# Altium project Secondary Protection.PrjPCB
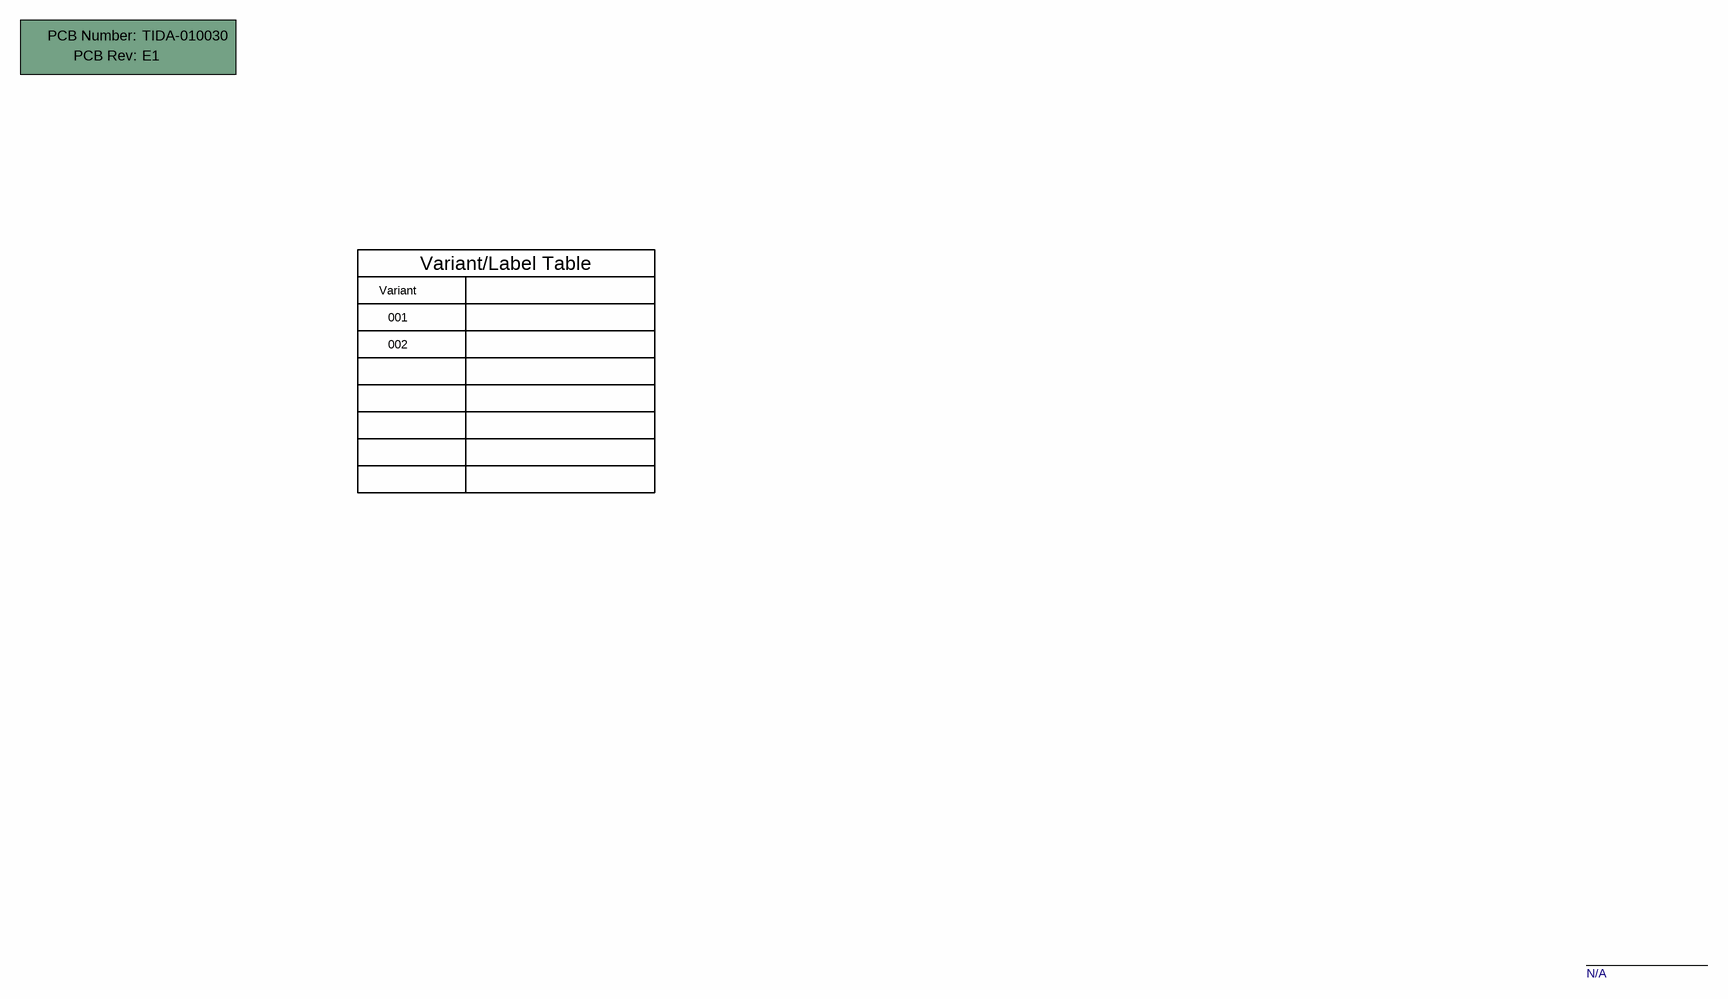
[diagram p0: EVM_Hardware.SchDoc]
TID: TIDA-010030; TechSupport: http://www.ti.com/support; SCH_Rev: E1; PRJ_Title: Accurate Gauging & 50uA Standby Current 13S 48V Liion  Battery Pack Reference Design; PRJ_Number: TIDA-010030; PRJ_Engineer: Ryan Tan; PRJ_Customer: Public Release; PCB_Rev: E1; PCB_Layout: Ryan Tan; CopyrightYear: 2018
2 sheets, 48 parts. Net scope: global (net labels, ports and power ports of the same name join across sheets).
Board file: Secondary Protection.PcbDoc
Sheets:
  EVM_Hardware.SchDoc
  Secondary protection.SchDoc

## Sheet EVM_Hardware.SchDoc
size 431 x 279 mm; Date: Not shown in title block; ApprovedBy: Not shown in title block; CheckedBy: Not shown in title block; Author: Not shown in title block; CompanyName: Not shown in title block; Engineer: Not shown in title block; Organization: Not shown in title block; Address1: Not shown in title block; Address2: Not shown in title block; Address3: Not shown in title block; Address4: Not shown in title block; DocumentNumber: 1; Revision: Use project parameter SCH_Rev; SheetNumber: 3; SheetTotal: 3; PageSetup: Record=PageOptions|CenterHorizontal=True|CenterVertical=True|PrintScale=1.00|XCorrection=1.00|YCorrection=1.00|PrintKind=0|BorderSize=5000000|LeftOffset=0|BottomOffset=0|Orientation=2|PaperLength=1000|PaperWidth=1000|Scale=100|PaperSource=15|PrintQuality=600|MediaType=1|DitherType=10|PaperKind=Letter|PrintScaleMode=1; CurrentTime: Not shown in title block; CurrentDate: Not shown in title block; Time: Not shown in title block; DocumentFullPathAndName: Not shown in title block; DocumentName: Not shown in title block; ModifiedDate: Not shown in title block; ImagePath: Not shown in title block

### Parts
!PCB1  Printed Circuit Board  (value not drawn)  (mechanical)

### Notes on the sheet
- Variant
- Variant/Label Table
- 001
- 002
- N/A
- Drawn By:
- SVN Rev:
- Number:
- TID #:
- Orderable:
- Rev:
- Sheet Title:
- File:
- Project Title:
- Designed for:
- Assembly Variant:
- Mod. Date:
- Sheet:
- Size:
- of
- B
- http://www.ti.com
- Texas Instruments and/or its licensors do not warrant the accuracy or completeness of this specification or any information contained therein. Texas Instruments and/or its licensors do not warrant that this design will meet the specifications, will be suitable for your application or fit for any particular purpose, or will operate in an implementation. Texas Instruments and/or its licensors do not warrant that the design is production worthy. You should completely validate and test your design implementation to confirm the system functionality for your application.
- Engineer:
- Contact:
- © Texas Instruments
- (in symbol CMP-0003618-2) PCB Number:; PCB Rev:

### Library data of the parts
!PCB1 = CMP-0003618-2: Manufacturer: Any; PartNumber: TIDA-010030; CompType: PCB; RoHS: O; MountType: N/A; Publisher: Texas Instruments; LatestRevisionDate: 2017-03-09; Key: PCB

## Sheet Secondary protection.SchDoc
size 431 x 279 mm; Date: Not shown in title block; ApprovedBy: Not shown in title block; CheckedBy: Not shown in title block; Author: Not shown in title block; CompanyName: Not shown in title block; Engineer: Not shown in title block; Organization: Not shown in title block; Address1: Not shown in title block; Address2: Not shown in title block; Address3: Not shown in title block; Address4: Not shown in title block; DocumentNumber: 1; Revision: Use project parameter SCH_Rev; SheetNumber: 2; SheetTotal: 3; PageSetup: Record=PageOptions|CenterHorizontal=True|CenterVertical=True|PrintScale=1.00|XCorrection=1.00|YCorrection=1.00|PrintKind=0|BorderSize=5000000|LeftOffset=0|BottomOffset=0|Orientation=2|PaperLength=1000|PaperWidth=1000|Scale=100|PaperSource=15|PrintQuality=600|MediaType=1|DitherType=10|PaperKind=Letter|PrintScaleMode=1; CurrentTime: Not shown in title block; CurrentDate: Not shown in title block; Time: Not shown in title block; DocumentFullPathAndName: Not shown in title block; DocumentName: Not shown in title block; ModifiedDate: Not shown in title block; ImagePath: Not shown in title block
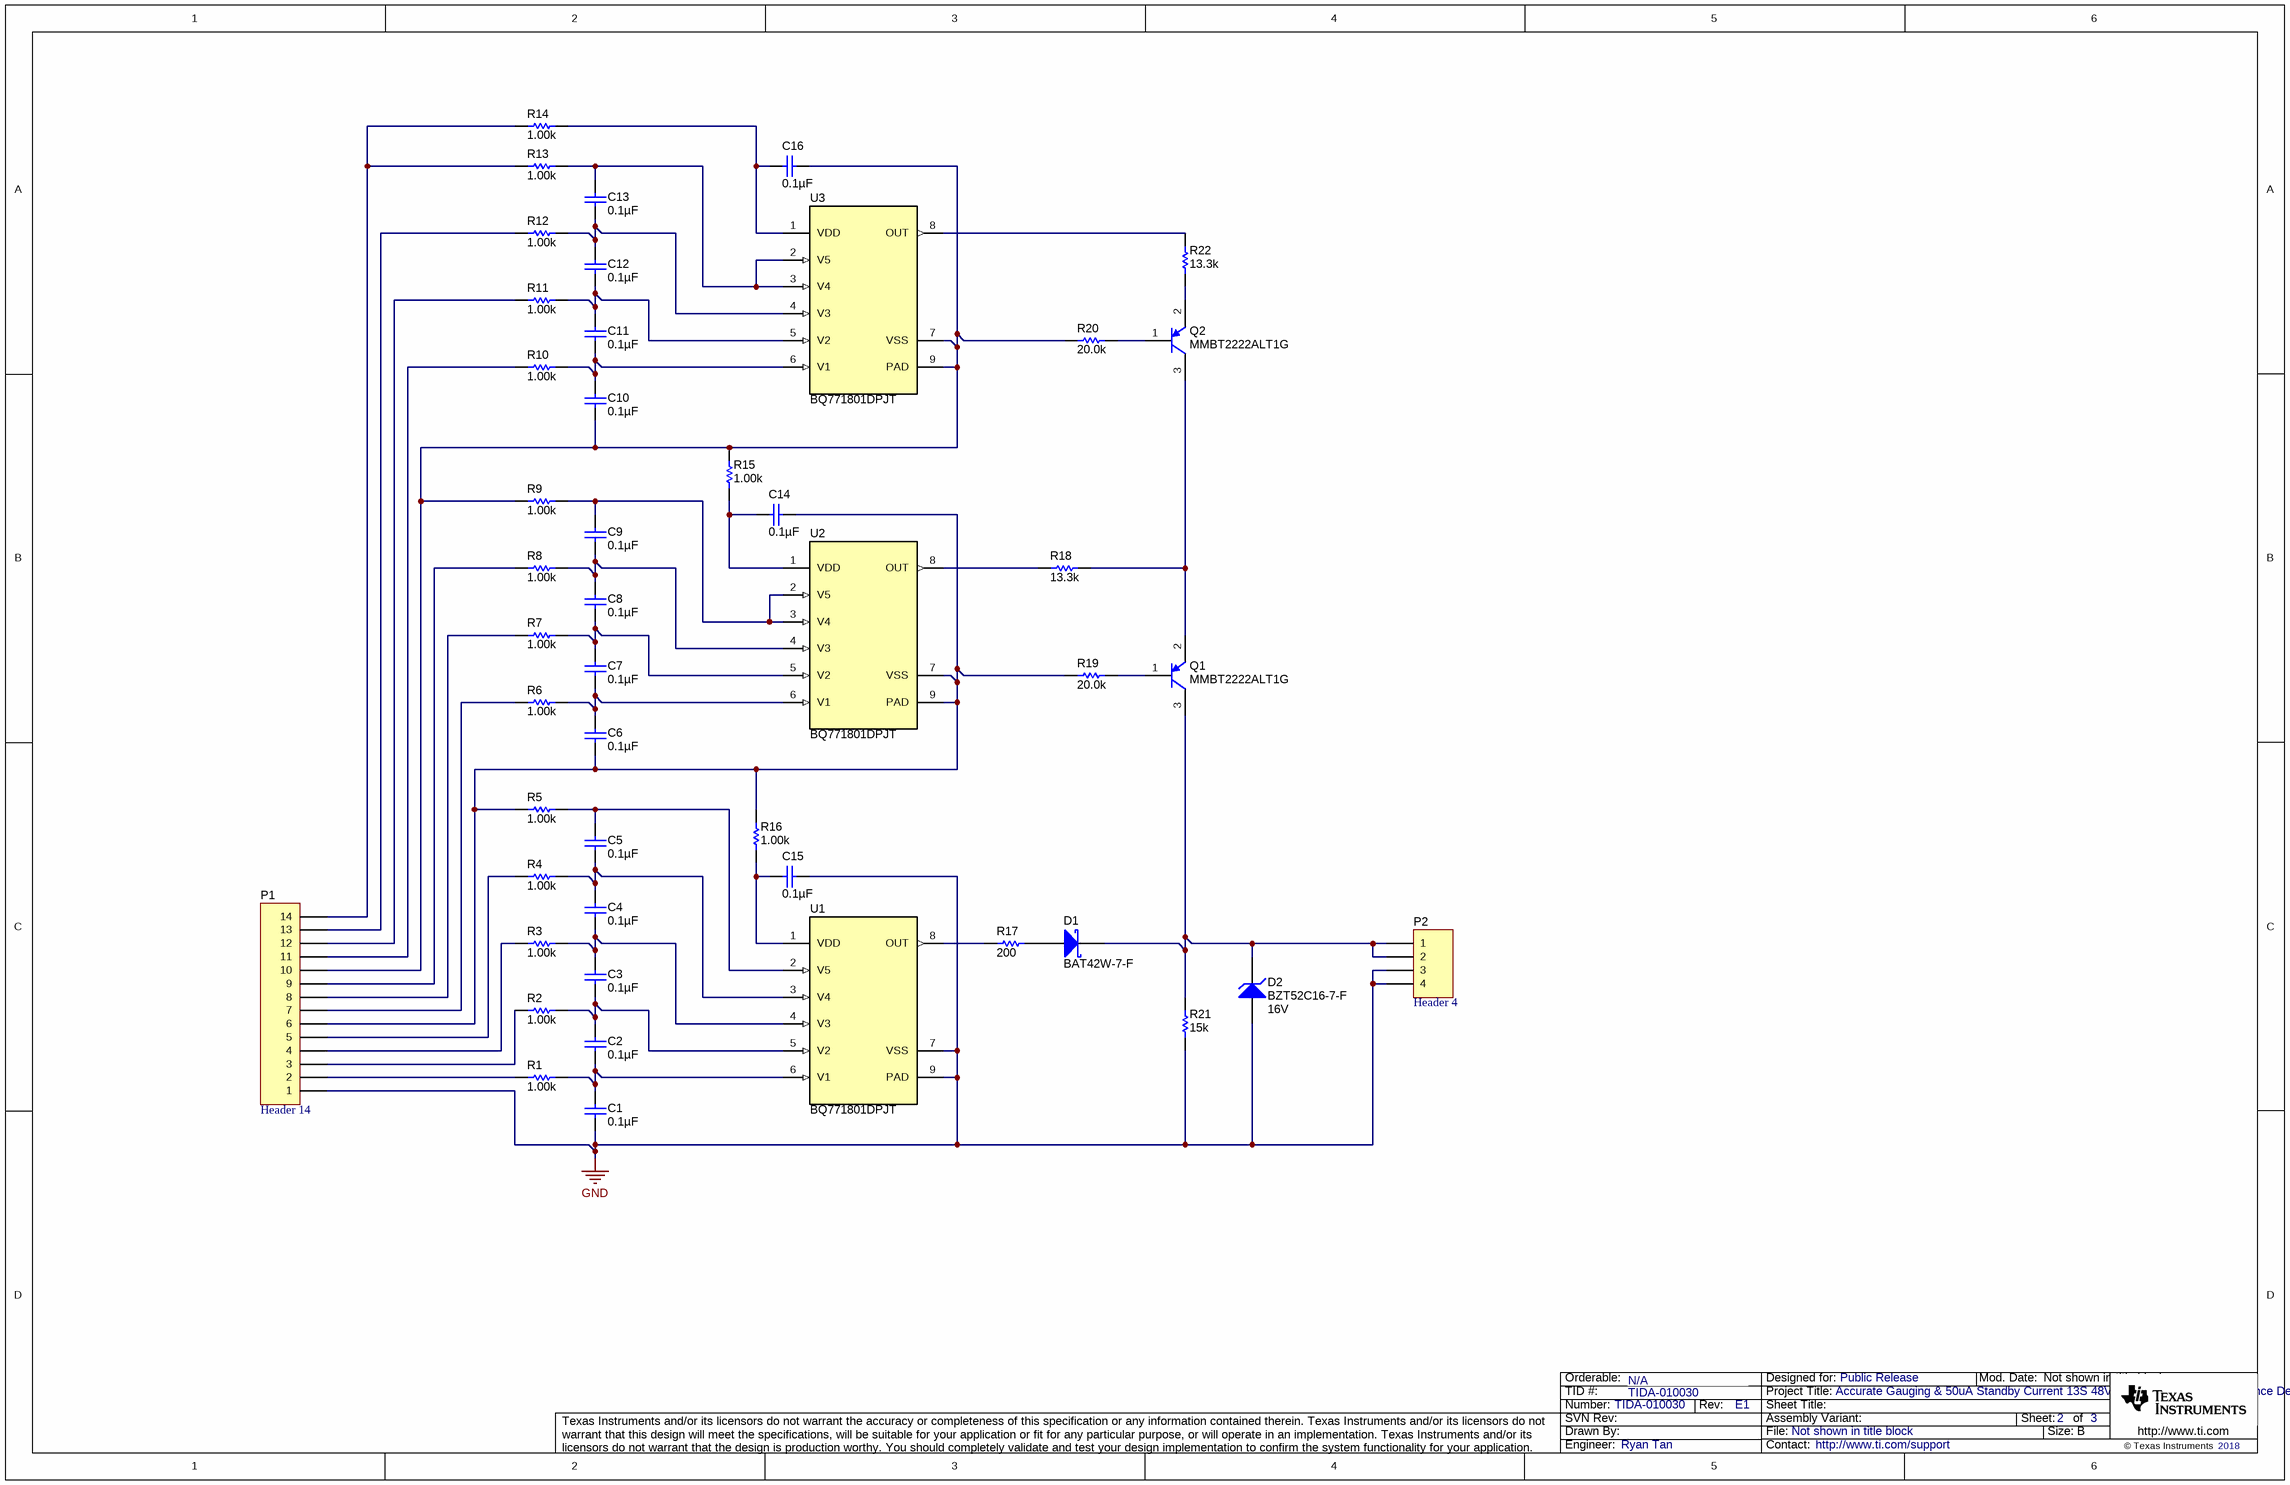
[diagram p1: Secondary protection.SchDoc]

### Parts
C1  ValueDisplayed: 0.1µF  [0603]  (hidden comment: GRM188R71H104KA93D)
C2  ValueDisplayed: 0.1µF  [0603]  (hidden comment: GRM188R71H104KA93D)
C3  ValueDisplayed: 0.1µF  [0603]  (hidden comment: GRM188R71H104KA93D)
C4  ValueDisplayed: 0.1µF  [0603]  (hidden comment: GRM188R71H104KA93D)
C5  ValueDisplayed: 0.1µF  [0603]  (hidden comment: GRM188R71H104KA93D)
C6  ValueDisplayed: 0.1µF  [0603]  (hidden comment: GRM188R71H104KA93D)
C7  ValueDisplayed: 0.1µF  [0603]  (hidden comment: GRM188R71H104KA93D)
C8  ValueDisplayed: 0.1µF  [0603]  (hidden comment: GRM188R71H104KA93D)
C9  ValueDisplayed: 0.1µF  [0603]  (hidden comment: GRM188R71H104KA93D)
C10  ValueDisplayed: 0.1µF  [0603]  (hidden comment: GRM188R71H104KA93D)
C11  ValueDisplayed: 0.1µF  [0603]  (hidden comment: GRM188R71H104KA93D)
C12  ValueDisplayed: 0.1µF  [0603]  (hidden comment: GRM188R71H104KA93D)
C13  ValueDisplayed: 0.1µF  [0603]  (hidden comment: GRM188R71H104KA93D)
C14  ValueDisplayed: 0.1µF  [0603]  (hidden comment: GRM188R71H104KA93D)
C15  ValueDisplayed: 0.1µF  [0603]  (hidden comment: GRM188R71H104KA93D)
C16  ValueDisplayed: 0.1µF  [0603]  (hidden comment: GRM188R71H104KA93D)
D1  BAT42W-7-F  [SOD-123]
D2  BZT52C16-7-F  value 16V  [SOD-123]
P1  Header 14  [HDR1X14]
P2  Header 4  [HDR1X4]
Q1  MMBT2222ALT1G  [SOT-23]
Q2  MMBT2222ALT1G  [SOT-23]
R1  ValueDisplayed: 1.00k  [0603]  (hidden comment: CRCW06031K00FKEA)
R2  ValueDisplayed: 1.00k  [0603]  (hidden comment: CRCW06031K00FKEA)
R3  ValueDisplayed: 1.00k  [0603]  (hidden comment: CRCW06031K00FKEA)
R4  ValueDisplayed: 1.00k  [0603]  (hidden comment: CRCW06031K00FKEA)
R5  ValueDisplayed: 1.00k  [0603]  (hidden comment: CRCW06031K00FKEA)
R6  ValueDisplayed: 1.00k  [0603]  (hidden comment: CRCW06031K00FKEA)
R7  ValueDisplayed: 1.00k  [0603]  (hidden comment: CRCW06031K00FKEA)
R8  ValueDisplayed: 1.00k  [0603]  (hidden comment: CRCW06031K00FKEA)
R9  ValueDisplayed: 1.00k  [0603]  (hidden comment: CRCW06031K00FKEA)
R10  ValueDisplayed: 1.00k  [0603]  (hidden comment: CRCW06031K00FKEA)
R11  ValueDisplayed: 1.00k  [0603]  (hidden comment: CRCW06031K00FKEA)
R12  ValueDisplayed: 1.00k  [0603]  (hidden comment: CRCW06031K00FKEA)
R13  ValueDisplayed: 1.00k  [0603]  (hidden comment: CRCW06031K00FKEA)
R14  ValueDisplayed: 1.00k  [0603]  (hidden comment: CRCW06031K00FKEA)
R15  ValueDisplayed: 1.00k  [0603]  (hidden comment: CRCW06031K00FKEA)
R16  ValueDisplayed: 1.00k  [0603]  (hidden comment: CRCW06031K00FKEA)
R17  ValueDisplayed: 200  [0603]  (hidden comment: CRCW0603200RJNEA)
R18  ValueDisplayed: 13.3k  [0603]  (hidden comment: CRCW060313K3FKEA)
R19  ValueDisplayed: 20.0k  [0603]  (hidden comment: CRCW060320K0FKEA)
R20  ValueDisplayed: 20.0k  [0603]  (hidden comment: CRCW060320K0FKEA)
R21  ValueDisplayed: 15k  [0603]  (hidden comment: CRCW060315K0JNEA)
R22  ValueDisplayed: 13.3k  [0603]  (hidden comment: CRCW060313K3FKEA)
U1  BQ771801DPJT  [DPJ0008A]
U2  BQ771801DPJT  [DPJ0008A]
U3  BQ771801DPJT  [DPJ0008A]

### Nets
GND: C1.2 C15.2 D2.2(A) P1.1 P2.3 P2.4 R21.2 U1.7(VSS) U1.9(PAD)
NetC1_1: C1.1 C2.2 R1.1 U1.6(V1)
NetC2_1: C2.1 C3.2 R2.1 U1.5(V2)
NetC3_1: C3.1 C4.2 R3.1 U1.4(V3)
NetC4_1: C4.1 C5.2 R4.1 U1.3(V4)
NetC5_1: C5.1 R5.1 U1.2(V5)
NetC6_1: C6.1 C7.2 R6.1 U2.6(V1)
NetC6_2: C6.2 C14.2 P1.6 R5.2 R16.1 R19.1 U2.7(VSS) U2.9(PAD)
NetC7_1: C7.1 C8.2 R7.1 U2.5(V2)
NetC8_1: C8.1 C9.2 R8.1 U2.4(V3)
NetC9_1: C9.1 R9.1 U2.2(V5) U2.3(V4)
NetC10_1: C10.1 C11.2 R10.1 U3.6(V1)
NetC10_2: C10.2 C16.2 P1.10 R9.2 R15.1 R20.1 U3.7(VSS) U3.9(PAD)
NetC11_1: C11.1 C12.2 R11.1 U3.5(V2)
NetC12_1: C12.1 C13.2 R12.1 U3.4(V3)
NetC13_1: C13.1 R13.1 U3.2(V5) U3.3(V4)
NetC14_1: C14.1 R15.2 U2.1(VDD)
NetC15_1: C15.1 R16.2 U1.1(VDD)
NetC16_1: C16.1 R14.1 U3.1(VDD)
NetD1_1: D1.1(K) D2.1(K) P2.1 P2.2 Q1.3(C) R21.1
NetD1_2: D1.2(A) R17.2
NetP1_2: P1.2 R1.2
NetP1_3: P1.3 R2.2
NetP1_4: P1.4 R3.2
NetP1_5: P1.5 R4.2
NetP1_7: P1.7 R6.2
NetP1_8: P1.8 R7.2
NetP1_9: P1.9 R8.2
NetP1_11: P1.11 R10.2
NetP1_12: P1.12 R11.2
NetP1_13: P1.13 R12.2
NetP1_14: P1.14 R13.2 R14.2
NetQ1_1: Q1.1(B) R19.2
NetQ1_2: Q1.2(E) Q2.3(C) R18.2
NetQ2_1: Q2.1(B) R20.2
NetQ2_2: Q2.2(E) R22.2
NetR17_1: R17.1 U1.8(OUT)
NetR18_1: R18.1 U2.8(OUT)
NetR22_1: R22.1 U3.8(OUT)

### Notes on the sheet
- N/A
- Drawn By:
- SVN Rev:
- Number:
- TID #:
- Orderable:
- Rev:
- Sheet Title:
- File:
- Project Title:
- Designed for:
- Assembly Variant:
- Mod. Date:
- Sheet:
- Size:
- of
- B
- http://www.ti.com
- Texas Instruments and/or its licensors do not warrant the accuracy or completeness of this specification or any information contained therein. Texas Instruments and/or its licensors do not warrant that this design will meet the specifications, will be suitable for your application or fit for any particular purpose, or will operate in an implementation. Texas Instruments and/or its licensors do not warrant that the design is production worthy. You should completely validate and test your design implementation to confirm the system functionality for your application.
- Engineer:
- Contact:
- © Texas Instruments

### Library data of the parts
C1-C16 = GRM188R71H104KA93D: CAP, CERM, 0.1 µF, 50 V,+/- 10%, X7R, 0603; Manufacturer: MuRata; Polarized: N; CompType: Capacitor; Value: 0.1uF; U/M: EA; Cap_F: 0.0000001; Tolerance_%: 10; VDC_V: 50; Value2: 50V; TaMin_C: -55; TaMax_C: 125; SizeArea_mm2: 1.28; SizeAreaWB_mm2: 4.68; SizeX_mm: 1.6; SizeY_mm: 0.8; SizeZ_mm: 1; AEC Category: Q200; Green_Lifecycle: Active; Green_REACh: Passed; SymbolVersion: 2008-07-09; PartNumber: GRM188R71H104KA93D; PackageReference: 0603; RoHS: Y; MountType: SMT; Technology: Ceramic; TempCo: X7R; Cap_Case: 0603; Published: 2008-06-19; Publisher: Texas Instruments; LatestRevisionDate: 2017-06-22; ComponentLink1Description: Datasheet link; ComponentLink1URL: http://search.murata.co.jp/Ceramy/PnsearchViewAction.do?HnOFG=ON&HnNFG=ON&SEL_CNT=50&sLang=en&sKey=GRM188R71H104KA93D&x=9&y=9&search=startwith; Supplier 1: Digi-Key; Supplier Part Number 1: 490-1519-1-ND; Supplier 2: Mouser; Supplier Part Number 2: 81-GRM39X104K50D; Supplier 3: Farnell; Supplier Part Number 3: 8820023; AEC Qualified: ?; Green_EU RoHS: Passed; Green_EU RoHS-2: Incomplete
D1 = BAT42W-7-F: Diode, Schottky, 30 V, 0.2 A, SOD-123; Manufacturer: Diodes Inc.; U/M: EA; Vf_V: 1; Value: 30V; Value1: 0.2A; Value2: 1V; Io_A: 0.2; Vr_V: 30; SizeAreaWB_mm2: 13.095; SizeArea_mm2: 6.545; SizeX_mm: 3.85; SizeY_mm: 1.7; SizeZ_mm: 1.35; AEC Category: Q101; Green_Lifecycle: Not Set; Green_REACh: Incomplete; CompType: Diode; SymbolVersion: 2008-12-08; PartNumber: BAT42W-7-F; PackageReference: SOD-123; MountType: SMT; Type: Schottky; RoHS: Y; Published: 2008-06-26; Publisher: Texas Instruments; LatestRevisionDate: 2017-06-26; ComponentLink1Description: Datasheet link; ComponentLink1URL: http://www.diodes.com/datasheets/ds30016.pdf; Supplier 1: Digi-Key; Supplier Part Number 1: BAT42WDICT-ND; Supplier 2: Mouser; Supplier Part Number 2: 621-BAT42W-F; Supplier 3: Farnell; Supplier Part Number 3: 1843718; AEC Qualified: ?; Green_EU RoHS: Incomplete; Green_EU RoHS-2: Incomplete
D2 = BZT52C16-7-F: Diode, Zener, 16 V, 500 mW, AEC-Q101, SOD-123; Manufacturer: Diodes Inc.; SymbolCreator: a0412235; U/M: EA; Power_W: 0.5; Vz_V: 16; Value1: 0.5W; RJA_CperW: 338; SizeAreaWB_mm2: 13.095; SizeArea_mm2: 6.545; SizeX_mm: 3.85; SizeY_mm: 1.7; SizeZ_mm: 1.35; AEC Category: Q101; AEC Qualified: Y; SymbolVersion: 2010-08-25; PartNumber: BZT52C16-7-F; PackageReference: SOD-123; CompType: Zener; Vr_V: N/A; MountType: SMT; RoHS: Y; ComponentLink1Description: Datasheet link; ComponentLink1URL: http://www.diodes.com/_files/datasheets/ds18004.pdf; Published: 2008-10-08; Publisher: Texas Instruments; LatestRevisionDate: 2017-06-20; LatestRevisionNote: Updated Supplier Data; Supplier 1: Digi-Key; Supplier Part Number 1: BZT52C16-FDICT-ND; Supplier 2: Mouser; Supplier Part Number 2: 621-BZT52C16-F
P1 = Header 14: Header, 14-Pin; LatestRevisionDate: 17-Jul-2002; LatestRevisionNote: Re-released for DXP Platform.; Publisher: Altium Limited
P2 = Header 4: Header, 4-Pin; LatestRevisionDate: 17-Jul-2002; LatestRevisionNote: Re-released for DXP Platform.; Publisher: Altium Limited
Q1 Q2 = MMBT3906-7-F, Diodes Inc.: Transistor, PNP, 40 V, 0.6 A, SOT-23; CompType: BJT; PNP: 1; NPN: 0; Vceo_V: 40; Vcesat1_V: 0.25; Value: 40 V; IcRated_A: 0.2; Value1: 0.2 A; HfeMax: 400; TaMin_C: -55; TaMax_C: 150; SizeAreaWB_mm2: 14; SizeArea_mm2: 7.5; SizeX_mm: 2.5; SizeY_mm: 3; SizeZ_mm: 1.1; U/M: EA; AEC Category: Q101; Green_Lifecycle: Active; Green_REACh: Passed; SymbolVersion: 2008-07-31; PartNumber: MMBT2222ALT1G; Manufacturer: Diodes Inc.; PackageReference: SOT-23; RoHS: Y; Value2: 400; Published: 2008-07-31; LatestRevisionDate: 2017-06-09; Publisher: Texas Instruments; ComponentLink1Description: Datasheet link; ComponentLink1URL: http://www.diodes.com/datasheets/ds30059.pdf; Supplier 1: Digi-Key; Supplier Part Number 1: MMBT3906-FDICT-ND; Supplier 2: Newark; Supplier Part Number 2: 51R6815; Supplier 3: Farnell; Supplier Part Number 3: 1773629; MountType: SMT; AEC Qualified: ?; Green_EU RoHS: Passed; Green_EU RoHS-2: Passed
R1-R16 = CRCW06031K00FKEA: RES, 1.00 k, 1%, 0.1 W, 0603; Manufacturer: Vishay-Dale; CompType: Resistor; Value: 1.00k; Res_ohm: 1000; Value_Code: 1k00; Tolerance_%: 1; Power_W: 0.1; Value2: 0.1W; VDC_V: 75; TempCo: 100 ppm/C; SizeArea_mm2: 1.28; SizeX_mm: 1.6; SizeY_mm: 0.8; EIA_Code: E96; U/M: EA; AEC Category: Q200; Green_Lifecycle: Active; Green_REACh: Passed; SymbolVersion: 2009-05-29; PartNumber: CRCW06031K00FKEA; PackageReference: 0603; RoHS: Y; Value1: 1%; MountType: SMT; Technology: Thick Film; SizeZ_mm: 1; Published: 2008-06-26; Publisher: Texas Instruments; LatestRevisionDate: 2017-06-13; ComponentLink1Description: Datasheet link; ComponentLink1URL: http://www.vishay.com/docs/20035/dcrcwe3.pdf; Supplier 1: Digi-Key; Supplier Part Number 1: 541-1.00KHCT-ND; Supplier 2: Newark; Supplier Part Number 2: 52K8015; Supplier 3: Mouser; Supplier Part Number 3: 71-CRCW0603-1.0K-E3; AEC Qualified: ?; Green_EU RoHS: Passed with Exemption; Green_EU RoHS-2: Passed
R17 = CRCW0603200RJNEA: RES, 200, 5%, 0.1 W, 0603; Manufacturer: Vishay-Dale; CompType: Resistor; Value: 200; Value_Code: 200R; Tolerance_%: 5; Power_W: 0.1; Value2: 0.1W; VDC_V: 75; TempCo: 200 ppm/C; SizeArea_mm2: 1.28; SizeX_mm: 1.6; SizeY_mm: 0.8; SizeZ_mm: 1; EIA_Code: E24; U/M: EA; AEC Category: Q200; Green_Lifecycle: Active; Green_REACh: Passed; SymbolVersion: 2009-05-29; PartNumber: CRCW0603200RJNEA; PackageReference: 0603; RoHS: Y; Res_ohm: 200; Value1: 5%; MountType: SMT; Technology: Thick Film; Published: 2008-06-26; Publisher: Texas Instruments; LatestRevisionDate: 2017-06-13; ComponentLink1Description: Datasheet link; ComponentLink1URL: http://www.vishay.com/docs/20035/dcrcwe3.pdf; Supplier 1: Digi-Key; Supplier Part Number 1: 541-200GCT-ND; Supplier 2: Newark; Supplier Part Number 2: 59M6785; Supplier 3: Mouser; Supplier Part Number 3: 71-CRCW0603J-200-E3; AEC Qualified: ?; Green_EU RoHS: Passed with Exemption; Green_EU RoHS-2: Passed
R18 R22 = CRCW060313K3FKEA: RES, 13.3 k, 1%, 0.1 W, 0603; Manufacturer: Vishay-Dale; CompType: Resistor; Value: 13.3k; Res_ohm: 13300; Value_Code: 13k3; Tolerance_%: 1; Power_W: 0.1; Value2: 0.1W; VDC_V: 75; TempCo: 100 ppm/C; SizeArea_mm2: 1.28; SizeX_mm: 1.6; SizeY_mm: 0.8; EIA_Code: E96; U/M: EA; AEC Category: Q200; Green_Lifecycle: Active; Green_REACh: Passed; SymbolVersion: 2009-05-29; PartNumber: CRCW060313K3FKEA; PackageReference: 0603; RoHS: Y; Value1: 1%; MountType: SMT; Technology: Thick Film; SizeZ_mm: 1; Published: 2008-06-26; Publisher: Texas Instruments; LatestRevisionDate: 2017-06-13; ComponentLink1Description: Datasheet link; ComponentLink1URL: http://www.vishay.com/docs/20035/dcrcwe3.pdf; Supplier 1: Digi-Key; Supplier Part Number 1: 541-13.3KHCT-ND; Supplier 2: Newark; Supplier Part Number 2: 52K8122; Supplier 3: Mouser; Supplier Part Number 3: 71-CRCW0603-13.3K-E3; AEC Qualified: ?; Green_EU RoHS: Passed with Exemption; Green_EU RoHS-2: Passed
R19 R20 = CRCW060320K0FKEA: RES, 20.0 k, 1%, 0.1 W, 0603; Manufacturer: Vishay-Dale; CompType: Resistor; Value: 20.0k; Res_ohm: 20000; Value_Code: 20k0; Tolerance_%: 1; Power_W: 0.1; Value2: 0.1W; VDC_V: 75; TempCo: 100 ppm/C; SizeArea_mm2: 1.28; SizeX_mm: 1.6; SizeY_mm: 0.8; EIA_Code: E96; U/M: EA; AEC Category: Q200; Green_Lifecycle: Active; Green_REACh: Passed; SymbolVersion: 2009-05-29; PartNumber: CRCW060320K0FKEA; PackageReference: 0603; RoHS: Y; Value1: 1%; MountType: SMT; Technology: Thick Film; SizeZ_mm: 1; Published: 2008-06-26; Publisher: Texas Instruments; LatestRevisionDate: 2017-06-13; ComponentLink1Description: Datasheet link; ComponentLink1URL: http://www.vishay.com/docs/20035/dcrcwe3.pdf; Supplier 1: Digi-Key; Supplier Part Number 1: 541-20.0KHCT-ND; Supplier 2: Newark; Supplier Part Number 2: 52K8267; Supplier 3: Mouser; Supplier Part Number 3: 71-CRCW0603-20K-E3; AEC Qualified: ?; Green_EU RoHS: Passed with Exemption; Green_EU RoHS-2: Passed
R21 = CRCW060315K0JNEA: RES, 15 k, 5%, 0.1 W, 0603; Manufacturer: Vishay-Dale; CompType: Resistor; Value: 15k; Res_ohm: 15000; Value_Code: 15k0; Tolerance_%: 5; Power_W: 0.1; Value2: 0.1W; VDC_V: 75; TempCo: 200 ppm/C; SizeArea_mm2: 1.28; SizeX_mm: 1.6; SizeY_mm: 0.8; SizeZ_mm: 1; EIA_Code: E24; U/M: EA; AEC Category: Q200; Green_Lifecycle: Active; Green_REACh: Passed; SymbolVersion: 2009-05-29; PartNumber: CRCW060315K0JNEA; PackageReference: 0603; RoHS: Y; Value1: 5%; MountType: SMT; Technology: Thick Film; Published: 2008-06-26; Publisher: Texas Instruments; LatestRevisionDate: 2017-06-13; ComponentLink1Description: Datasheet link; ComponentLink1URL: http://www.vishay.com/docs/20035/dcrcwe3.pdf; Supplier 1: Digi-Key; Supplier Part Number 1: 541-15KGCT-ND; Supplier 2: Newark; Supplier Part Number 2: 59M6768; Supplier 3: Mouser; Supplier Part Number 3: 71-CRCW0603J-15K-E3; AEC Qualified: ?; Green_EU RoHS: Passed with Exemption; Green_EU RoHS-2: Passed
U1-U3 = CMP-0078897-2: Family 2-5S Overvoltage Protector with Internal Delay Timer, DPJ0008A (WSON-8); Alternate PartNumber: BQ771801DPJR; Alternate Manufacturer: Texas Instruments; SizeAreaWB_mm2: 20; SizeZ_mm: 0.8; SizeX_mm: 4; SizeY_mm: 3; SizeArea_mm2: 12; CompType: IC; AEC Qualified: N; AEC Category: Q200; ComponentLink1URL: http://www.ti.com/lit/ds/symlink/bq7718.pdf; PackageDescription: WSON-8; RoHS: Y; MountType: SMT; ComponentLink2URL: http://www.ti.com/product/bq7718; ComponentLink2Description: Product Folder; Manufacturer: Texas Instruments; PackageReference: DPJ0008A; PartNumber: BQ771801DPJT; ComponentLink1Description: Datasheet Link

## Assembly variants
001: not fitted FID1 FID2 FID3